# Altium schematic sheet Circuit-tetanos.SchDoc
size A2; SheetNumber: 1; SheetTotal: 2
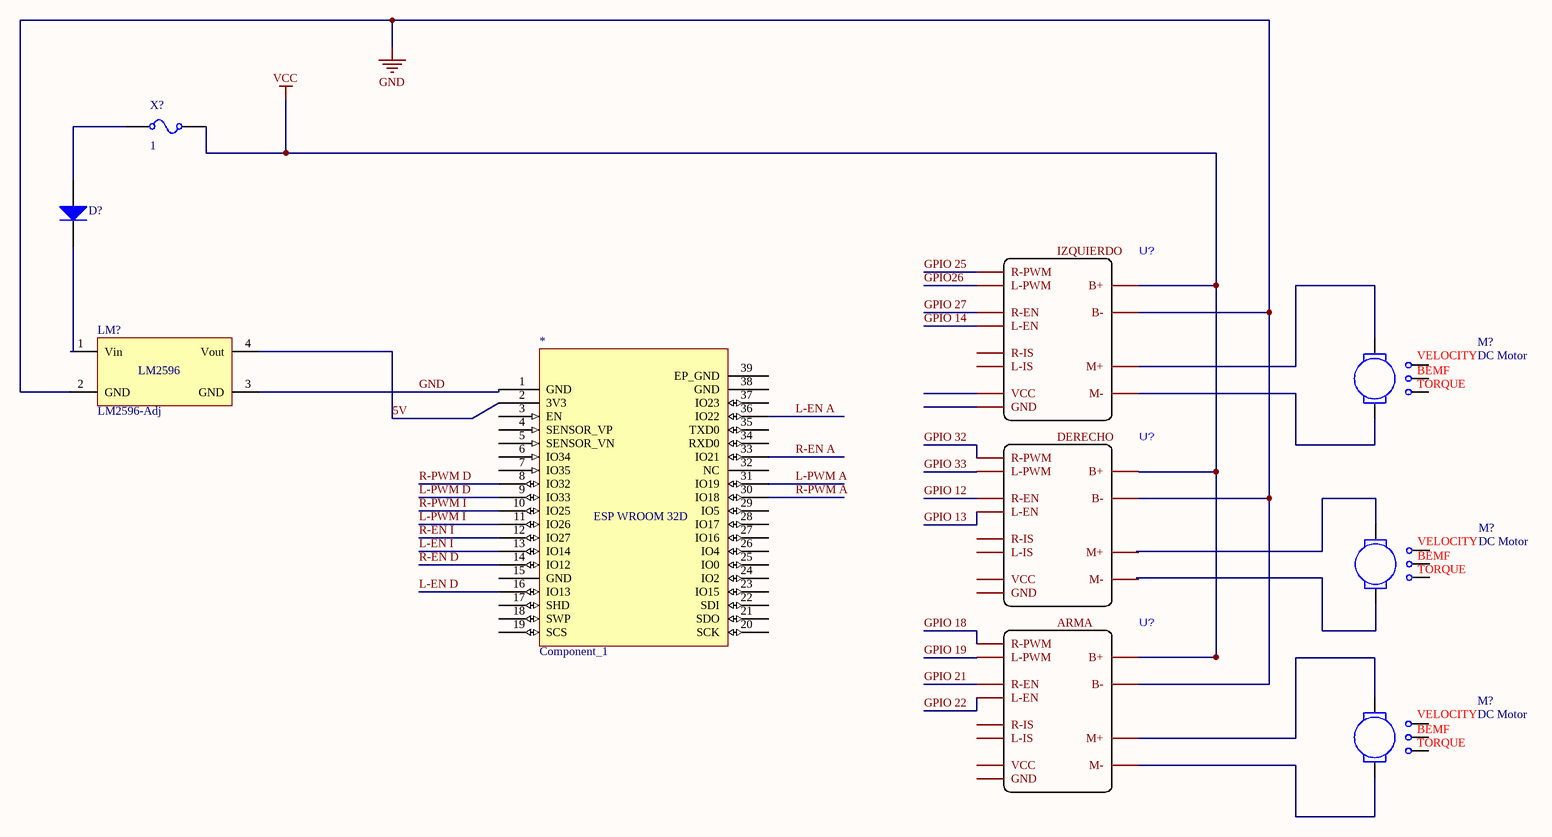
[diagram p0: Circuit-tetanos.SchDoc]

## Parts
(Parts that share a designator on the sheet are numbered #1, #2 ... from top to bottom, then left to right.)
*  Component_1  [ESP32-WROOM-32D]
D?  Diode  (value not drawn)
LM?  LM2596-Adj  [lm2596]
M?#1  DC Motor
M?#2  DC Motor
M?#3  DC Motor
U?#1  (no value)  [BTS7960 ADAL]
U?#2  (no value)  [BTS7960 ADAL]
U?#3  (no value)  [BTS7960 ADAL]
X?  CURRENT: 1  (hidden comment: Fuse)

## Nets
GND: *.1(GND) LM?.2(GND) LM?.3(GND) U?#1.9(B-) U?#2.9(B-) U?#3.9(B-)
VCC: U?#1.10(B+) U?#2.10(B+) U?#3.10(B+) X?.2
5V : *.2(3V3) LM?.4(Vout)
GPIO26: U?#1.2(L-PWM)
GPIO 12: U?#2.3(R-EN)
GPIO 13: U?#2.4(L-EN)
GPIO 14: U?#1.4(L-EN)
GPIO 18: U?#3.1(R-PWM)
GPIO 19: U?#3.2(L-PWM)
GPIO 21: U?#3.3(R-EN)
GPIO 22: U?#3.4(L-EN)
GPIO 25: U?#1.1(R-PWM)
GPIO 27: U?#1.3(R-EN)
GPIO 32: U?#2.1(R-PWM)
GPIO 33: U?#2.2(L-PWM)
L-EN A: *.36(IO22)
L-EN D: *.16(IO13)
L-EN I: *.13(IO14)
L-PWM A: *.31(IO19)
L-PWM D: *.9(IO33)
L-PWM I: *.11(IO26)
R-EN A: *.33(IO21)
R-EN D: *.14(IO12)
R-EN I: *.12(IO27)
R-PWM A: *.30(IO18)
R-PWM D: *.8(IO32)
R-PWM I: *.10(IO25)
NetD?_1: D?.1(A) X?.1
NetD?_2: D?.2(K) LM?.1(Vin)
NetM?#1_1: M?#1.1 U?#1.12(M+)
NetM?#1_2: M?#1.2 U?#1.11(M-)
NetM?#3_1: M?#3.1 U?#3.12(M+)
NetM?#3_2: M?#3.2 U?#3.11(M-)

Not connected (* = marked no-connect by the designer): * 3(EN) 4(SENSOR_VP) 5(SENSOR_VN) 6(IO34) 7(IO35) 15(GND) 17(SHD) 18(SWP) 19(SCS) 20(SCK) 21(SDO) 22(SDI) 23(IO15) 24(IO2) 25(IO0) 26(IO4) 27(IO16) 28(IO17) 29(IO5) 32(NC) 34(RXD0) 35(TXD0) 37(IO23) 38(GND) 39(EP_GND); M?#1 3 4 5; M?#2 1 2 3 4 5; M?#3 3 4 5; U?#1 5(R-IS) 6(L-IS) 7(VCC) 8(GND); U?#2 5(R-IS) 6(L-IS) 7(VCC) 8(GND) 11(M-) 12(M+); U?#3 5(R-IS) 6(L-IS) 7(VCC) 8(GND)

## Notes on the sheet
- Labels drawn without touching a wire or pin: ARMA, DERECHO, IZQUIERDO
- (in symbol Component_1) ESP WROOM 32D
- (in symbol DC Motor) VELOCITY; BEMF; TORQUE
- (in symbol LM2596-Adj) LM2596

## Library data of the parts
D? = Diode: AF: 1; BV: 0; BV_MAX: 1e99; EG: 1.11; FC: 0.5; IBV: 0.001; ISR: 1e-14; MJSW: 0.33; NTUN: 30; TNOM: 27; XTI: 3; SimulationGenericComponent: True; CJO: 0; CJP: 0; CTA: 0; CTP: 0; FCS: 0.5; FV_MAX: 1e99; IKF: 0; IKR: 0; JSW: 0; JTUN: 0; JTUNSW: 0; KEG: 1; KF: 0; LEVEL: 1; N: 1; NBV: 1; NR: 1; NS: 1; PHP: 1; RS: 0; TCV: 0; TLEV: 0; TLEVC: 0; TM1: 0; TM2: 0; TPB: 0; TPHP: 0; TRS: 0; TRS2: 0; TT: 0; TTT1: 0; TTT2: 0; VJ: 1; XTITUN: 3; IS: 1e-14
LM? = LM2596-Adj: Designed By @Alixahedi
M?#1-M?#3 = DC Motor: LA: 1.5M; RA: 0.5; KE: 0.05; JM: 250U; BM: 0.1M; TL: 0; SimulationGenericComponent: True; KT: 0.05
U?#1-U?#3 = BTS7960 MODULE
X? = Fuse: RESISTANCE: 1m; SimulationGenericComponent: True